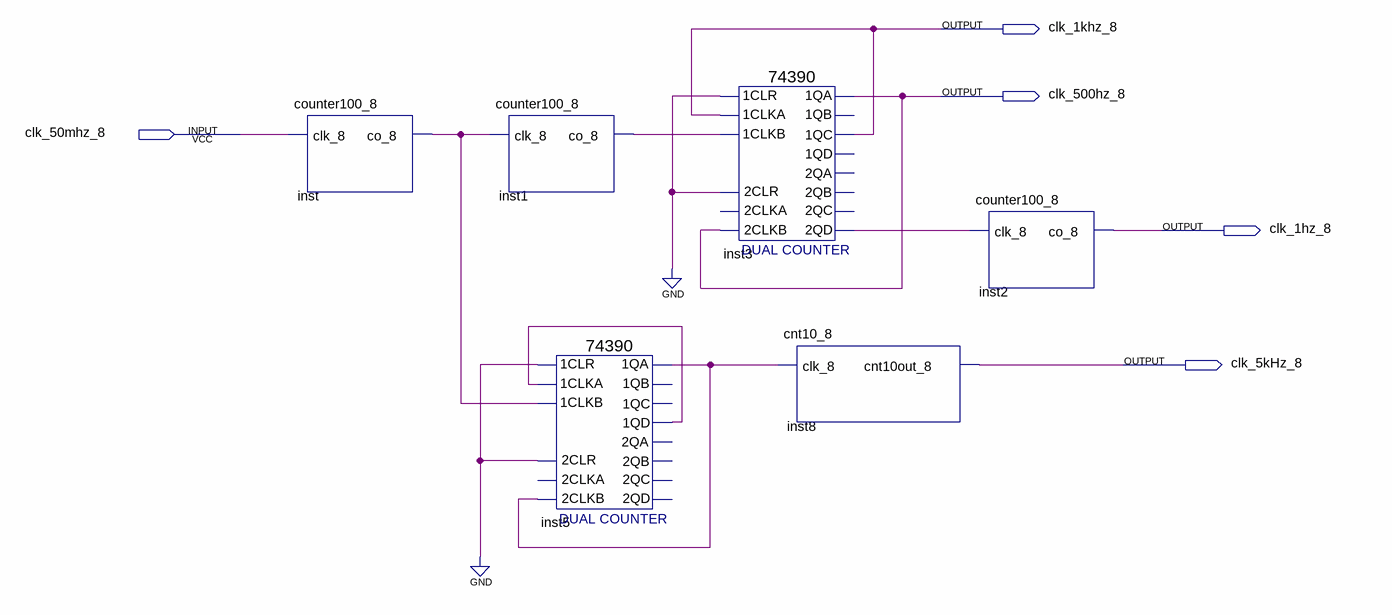
[diagram p0: schematic sheet]
// Quartus schematic fre_div_8.bdf as structural Verilog: 6 symbols, 5 pins
module fre_div_8 (
  input  clk_50mhz_8,
  output clk_1khz_8,
  output clk_500hz_8,
  output clk_1hz_8,
  output clk_5kHz_8
);

  wire inst1_co_8, inst3_2qd, inst5_1qa, inst5_1qd, inst_co_8;

  counter100_8 inst (.clk_8(clk_50mhz_8), .co_8(inst_co_8));
  counter100_8 inst1 (.clk_8(inst_co_8), .co_8(inst1_co_8));
  \74390  inst5 (
    .\2CLR (1'b0), .\2CLKB (inst5_1qa), .\1CLR (1'b0), .\1CLKA (inst5_1qd), .\1CLKB (inst_co_8),
    .\1QA (inst5_1qa), .\1QD (inst5_1qd));  // open: 2CLKA, 1QB, 1QC, 2QA, 2QB, 2QC, 2QD
  \74390  inst3 (
    .\2CLR (1'b0), .\2CLKB (clk_500hz_8), .\1CLR (1'b0), .\1CLKA (clk_1khz_8), .\1CLKB (inst1_co_8),
    .\1QA (clk_500hz_8), .\1QC (clk_1khz_8), .\2QD (inst3_2qd));  // open: 2CLKA, 1QB, 1QD, 2QA, 2QB, 2QC
  cnt10_8 inst8 (.clk_8(inst5_1qa), .cnt10out_8(clk_5kHz_8));
  counter100_8 inst2 (.clk_8(inst3_2qd), .co_8(clk_1hz_8));
endmodule
